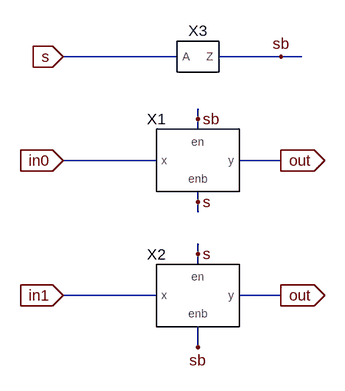
[diagram p0: schematic sel21.asc]
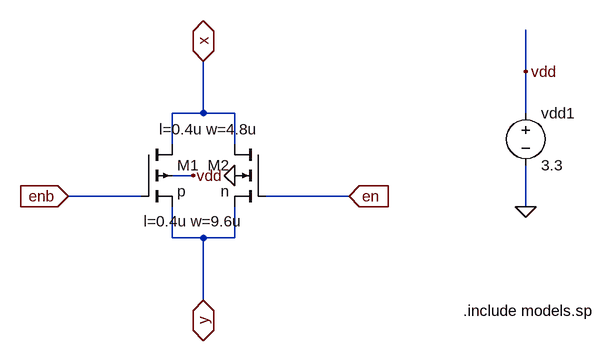
[diagram p1: sub-circuit tri_gate.asc]
sel21.asc, the LTspice schematic file:
Version 4
SHEET 1 880 680
WIRE 128 -48 -48 -48
WIRE 288 -48 192 -48
WIRE 320 -48 288 -48
WIRE 160 48 160 32
WIRE 160 64 160 48
WIRE 96 112 -48 112
WIRE 288 112 224 112
WIRE 160 176 160 160
WIRE 160 192 160 176
WIRE 160 256 160 240
WIRE 160 272 160 256
WIRE 96 320 -48 320
WIRE 288 320 224 320
WIRE 160 400 160 368
FLAG -48 112 in0
IOPIN -48 112 In
FLAG -48 320 in1
IOPIN -48 320 In
FLAG -48 -48 s
IOPIN -48 -48 In
FLAG 288 -48 sb
FLAG 288 112 out
IOPIN 288 112 Out
FLAG 288 320 out
IOPIN 288 320 Out
FLAG 160 256 s
FLAG 160 176 s
FLAG 160 48 sb
FLAG 160 400 sb
SYMBOL tri_gate 160 112 R0
SYMATTR InstName X1
SYMBOL tri_gate 160 320 R0
SYMATTR InstName X2
SYMBOL inv 160 -48 R0
SYMATTR InstName X3

tri_gate.asc, the sub-circuit schematic file:
Version 4
SHEET 1 880 680
WIRE 576 -16 576 -80
WIRE 80 48 80 -32
WIRE 80 48 32 48
WIRE 128 48 80 48
WIRE 576 48 576 -16
WIRE 32 96 32 48
WIRE 128 96 128 48
WIRE 64 144 32 144
WIRE -16 176 -128 176
WIRE 304 176 176 176
WIRE 576 192 576 128
WIRE 32 240 32 192
WIRE 80 240 32 240
WIRE 128 240 128 192
WIRE 128 240 80 240
WIRE 80 336 80 240
FLAG 128 144 0
FLAG 64 144 vdd
FLAG 576 192 0
FLAG 576 -16 vdd
FLAG 80 336 y
IOPIN 80 336 BiDir
FLAG 80 -32 x
IOPIN 80 -32 BiDir
FLAG 304 176 en
IOPIN 304 176 In
FLAG -128 176 enb
IOPIN -128 176 In
SYMBOL pmos4 -16 96 R0
WINDOW 123 4 118 Left 2
SYMATTR Value2 l=0.4u w=9.6u
SYMATTR InstName M1
SYMATTR Value p
SYMBOL nmos4 176 96 M0
WINDOW 123 12 -23 Left 2
SYMATTR Value2 l=0.4u w=4.8u
SYMATTR InstName M2
SYMATTR Value n
SYMBOL voltage 576 32 R0
WINDOW 123 0 0 Left 0
WINDOW 39 0 0 Left 0
SYMATTR InstName vdd1
SYMATTR Value 3.3
TEXT 480 352 Left 2 !.include models.sp

The netlist it stands for:
* sel21.asc
XX1 sb s in0 out tri_gate
XX2 s sb in1 out tri_gate
XX3 s sb inv  ; pins A Z

* block symbol definitions
.subckt tri_gate en enb x y
M1 x enb y vdd p l=0.4u w=9.6u
M2 x en y 0 n l=0.4u w=4.8u
vdd1 vdd 0 3.3
.include models.sp
.ends tri_gate

.model NMOS NMOS
.model PMOS PMOS
.lib standard.mos
.backanno
.end